# EAGLE schematic car v6 (EAGLE 9.7.0)
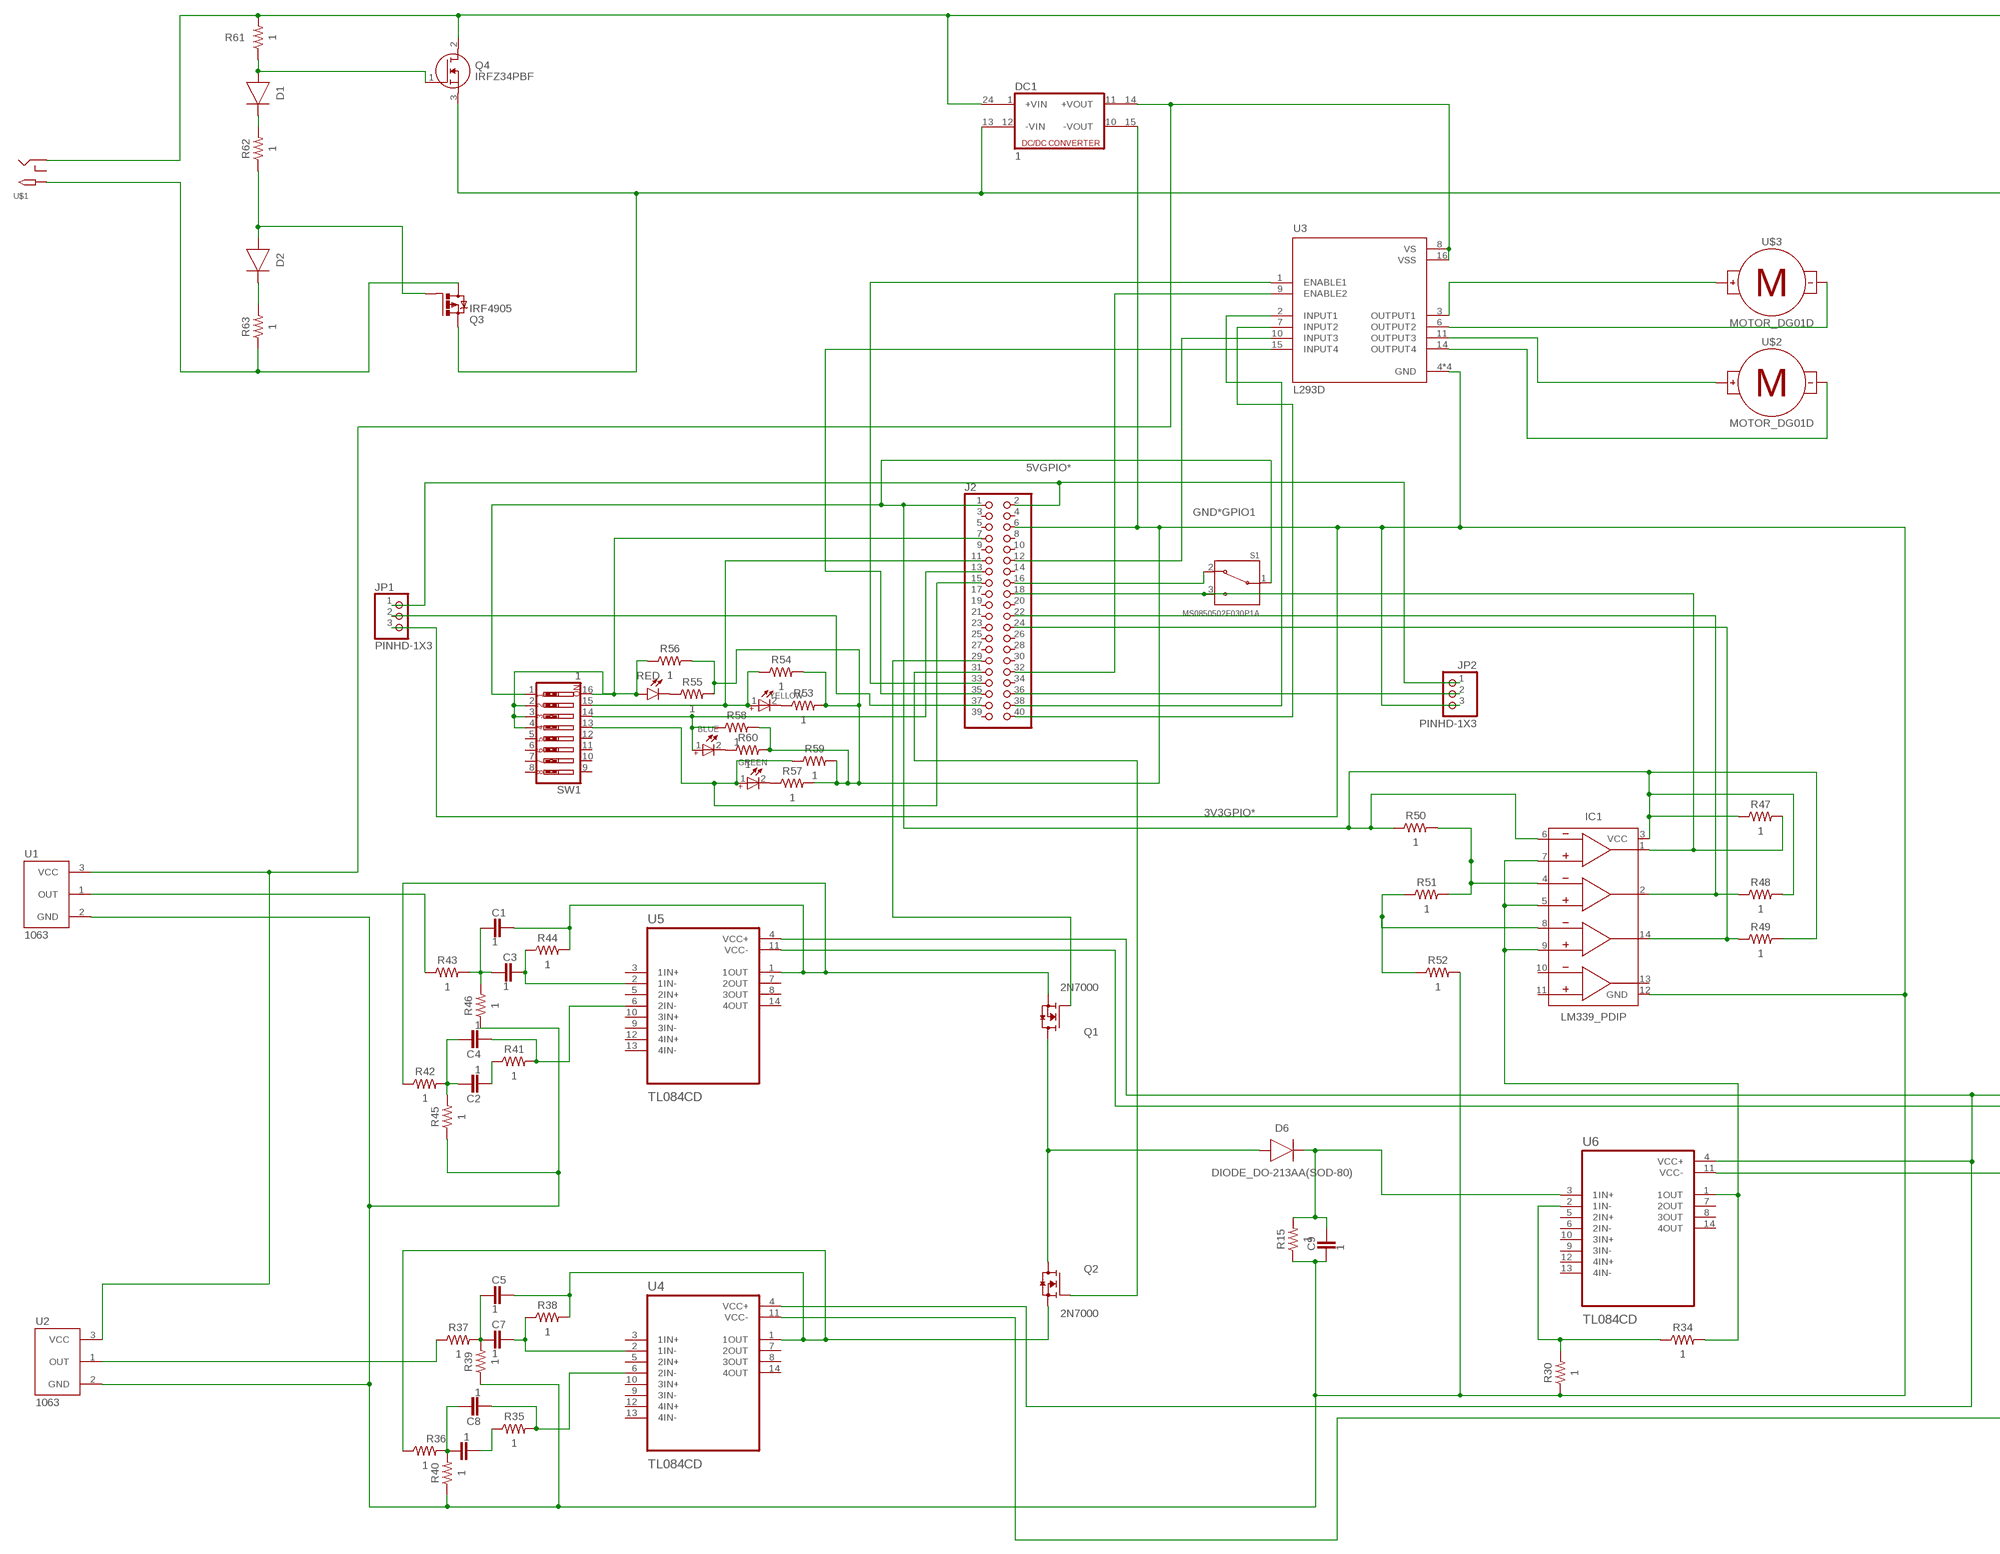
[diagram p0: schematic, sheet 1, part 1 of 2]
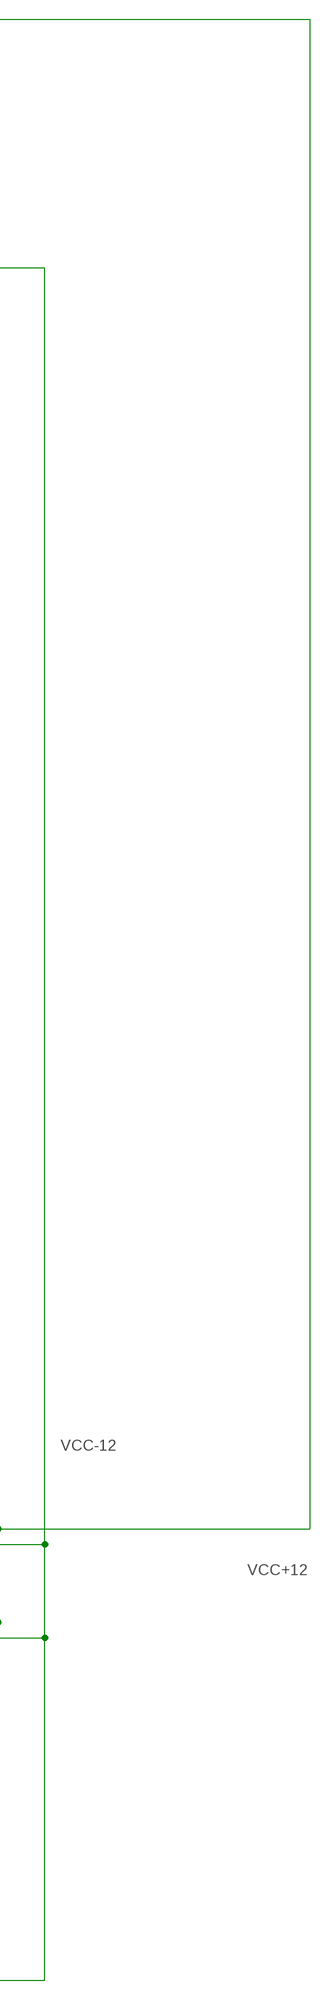
[diagram p1: schematic, sheet 1, part 2 of 2]

## Parts
BLUE  WL-TMRC_5MM_WITHOUTSTOPPER  [WL-TMRC_5MM]
C1  1  CAPACITOR_CHIP-0402(1005-METRIC)  [CAPC1005X60]
C2  1  CAPACITOR_CHIP-0402(1005-METRIC)  [CAPC1005X60]
C3  1  CAPACITOR_CHIP-0402(1005-METRIC)  [CAPC1005X60]
C4  1  CAPACITOR_CHIP-0402(1005-METRIC)  [CAPC1005X60]
C5  1  CAPACITOR_CHIP-0402(1005-METRIC)  [CAPC1005X60]
C6  1  CAPACITOR_CHIP-0402(1005-METRIC)  [CAPC1005X60]
C7  1  CAPACITOR_CHIP-0402(1005-METRIC)  [CAPC1005X60]
C8  1  CAPACITOR_CHIP-0402(1005-METRIC)  [CAPC1005X60]
C9  1  CAPACITOR_CHIP-0402(1005-METRIC)  [CAPC1005X60]
D1  DIODE_DO-213AA(SOD-80)  [DIOMELF3516]
D2  DIODE_DO-213AA(SOD-80)  [DIOMELF3516]
D6  DIODE_DO-213AA(SOD-80)  [DIOMELF3516]
DC1  1  DC213R  [CMK]
GREEN  WL-TMRC_3MM_WITHOUTSTOPPER  [WL-TMRC_3MM]
IC1  LM339_PDIP  [DIP762W53P254L1969H508Q14B]
J2  PiHeaderM  PINHD-2X20  [2X20]
JP1  PINHD-1X3  [1X03]
JP2  PINHD-1X3  [1X03]
Q1  2N7000  [TO92254P458H750-3]
Q2  2N7000  [TO92254P458H750-3]
Q3  IRF4905  [TO220BH]
Q4  IRFZ34PBF  [TO254P465X1024X2050-3P]
R15  1  R-US_CHIP-0402(1005-METRIC)  [RESC1005X40]
R30  1  R-US_CHIP-0402(1005-METRIC)  [RESC1005X40]
R34  1  R-US_CHIP-0402(1005-METRIC)  [RESC1005X40]
R35  1  R-US_CHIP-0402(1005-METRIC)  [RESC1005X40]
R36  1  R-US_CHIP-0402(1005-METRIC)  [RESC1005X40]
R37  1  R-US_CHIP-0402(1005-METRIC)  [RESC1005X40]
R38  1  R-US_CHIP-0402(1005-METRIC)  [RESC1005X40]
R39  1  R-US_CHIP-0402(1005-METRIC)  [RESC1005X40]
R40  1  R-US_CHIP-0402(1005-METRIC)  [RESC1005X40]
R41  1  R-US_CHIP-0402(1005-METRIC)  [RESC1005X40]
R42  1  R-US_CHIP-0402(1005-METRIC)  [RESC1005X40]
R43  1  R-US_CHIP-0402(1005-METRIC)  [RESC1005X40]
R44  1  R-US_CHIP-0402(1005-METRIC)  [RESC1005X40]
R45  1  R-US_CHIP-0402(1005-METRIC)  [RESC1005X40]
R46  1  R-US_CHIP-0402(1005-METRIC)  [RESC1005X40]
R47  1  R-US_CHIP-0402(1005-METRIC)  [RESC1005X40]
R48  1  R-US_CHIP-0402(1005-METRIC)  [RESC1005X40]
R49  1  R-US_CHIP-0402(1005-METRIC)  [RESC1005X40]
R50  1  R-US_CHIP-0402(1005-METRIC)  [RESC1005X40]
R51  1  R-US_CHIP-0402(1005-METRIC)  [RESC1005X40]
R52  1  R-US_CHIP-0402(1005-METRIC)  [RESC1005X40]
R53  1  R-US_CHIP-0402(1005-METRIC)  [RESC1005X40]
R54  1  R-US_CHIP-0402(1005-METRIC)  [RESC1005X40]
R55  1  R-US_CHIP-0402(1005-METRIC)  [RESC1005X40]
R56  1  R-US_CHIP-0402(1005-METRIC)  [RESC1005X40]
R57  1  R-US_CHIP-0402(1005-METRIC)  [RESC1005X40]
R58  1  R-US_CHIP-0402(1005-METRIC)  [RESC1005X40]
R59  1  R-US_CHIP-0402(1005-METRIC)  [RESC1005X40]
R60  1  R-US_CHIP-0402(1005-METRIC)  [RESC1005X40]
R61  1  R-US_CHIP-0402(1005-METRIC)  [RESC1005X40]
R62  1  R-US_CHIP-0402(1005-METRIC)  [RESC1005X40]
R63  1  R-US_CHIP-0402(1005-METRIC)  [RESC1005X40]
RED  LED_RADIALRED  [LEDRD254W60D565H860B_R]
S1  MS0850502F030P1A  [SW_MS0850502F030P1A]
SW1  1  SW_DIP-8  [EDG-08]
U1  1063  [MODULE_1063]
U2  1063  [MODULE_1063]
U3  L293D  [DIP880W50P254L2000H510Q16]
U4  TL084CD  [SOIC127P600X175-14N]
U5  TL084CD  [SOIC127P600X175-14N]
U6  TL084CD  [SOIC127P600X175-14N]
U$1  2.1MMJACKTHM  [PJ-102A]
U$2  MOTOR_DG01D  [DG01D]
U$3  MOTOR_DG01D  [DG01D]
YELLOW  WL-TMRC_3MM_WITHOUTSTOPPER  [WL-TMRC_3MM]

## Nets
3V3GPIO*: IC1.3(VCC) IC1.6(-IN1) J2.1 R47.1 R48.2 R49.2 R50.1 S1.1(COM) SW1.1
5VGPIO*: J2.2 JP1.1 JP2.1
GND*GPIO1: C9.2 DC1.15(-VOUT1) IC1.12(GND) J2.6 JP1.3 JP2.3 R15.1 R30.1 R39.1 R40.1 R45.1 R46.1 R52.2 R53.2 R54.2 R55.2 R56.2 R57.2 R58.2 R59.2 R60.2 U1.2(GND) U2.2(GND) U3.4(GND) U3.5(GND) U3.12(GND) U3.13(GND)
GPIO4*: J2.7 R56.1 RED.A SW1.2 SW1.3 SW1.4 SW1.16
GPIO5*: J2.29 Q1.2(G)
GPIO6*: J2.31 Q2.2(G)
GPIO8*: IC1.14(OUT3) J2.24 R49.1
GPIO12*: J2.32 U3.9(ENABLE2)
GPIO13*: J2.33 U3.1(ENABLE1)
GPIO16*: J2.36 JP2.2
GPIO17*: J2.11 R54.1 SW1.15 YELLOW.1(+)
GPIO18*: J2.12 U3.10(INPUT3)
GPIO19*: J2.35 U3.15(INPUT4)
GPIO20*: J2.38 U3.2(INPUT1)
GPIO21*: J2.40 U3.7(INPUT2)
GPIO22*: GREEN.1(+) J2.15 R59.1 SW1.13
GPIO23*: J2.16 S1.2(NC)
GPIO24*: IC1.1(OUT1) J2.18 R47.2 S1.3(NO)
GPIO25*: IC1.2(OUT2) J2.22 R48.1
GPIO26*: J2.37 JP1.2
GPIO27*: BLUE.1(+) J2.13 R58.1 SW1.14
N$1: D1.2(A) Q4.1(G) R61.1
N$2: D1.1(C) R62.2
N$3: D2.2(A) Q3.G R62.1
N$4: D2.1(C) R63.2
N$5: Q3.D R63.1 U$1.TIP
N$6: U3.11(OUTPUT3) U$2.+
N$7: U3.3(OUTPUT1) U$3.+
N$8: C1.2 C3.2 R43.2 R46.2
N$9: DC1.14(+VOUT1) U1.3(VCC) U2.3(VCC) U3.8(VS) U3.16(VSS)
N$12: C3.1 R44.1 U5.2(1IN-)
N$13: C2.1 C4.1 R42.2 R45.2
N$14: C2.2 R41.1
N$15: C1.1 Q1.1(S) R42.1 R44.2 U5.1(1OUT)
N$16: C4.2 R41.2 U5.6(2IN-)
N$17: R55.1 RED.C
N$18: R43.1 U1.1(OUT)
N$19: C5.2 C7.2 R37.2 R39.2
N$20: C7.1 R38.1 U4.2(1IN-)
N$21: C6.1 C8.1 R36.2 R40.2
N$22: C6.2 R35.1
N$23: C5.1 Q2.1(S) R36.1 R38.2 U4.1(1OUT)
N$24: C8.2 R35.2 U4.6(2IN-)
N$25: R53.1 YELLOW.2(-)
N$26: R37.1 U2.1(OUT)
N$27: C9.1 D6.1(C) R15.2 U6.3(1IN+)
N$28: GREEN.2(-) R57.1
N$29: D6.2(A) Q1.3(D) Q2.3(D)
N$30: BLUE.2(-) R60.1
N$31: IC1.4(-IN2) R50.2 R51.2
N$32: IC1.8(-IN3) R51.1 R52.1
N$33: U3.6(OUTPUT2) U$3.-
N$34: R30.2 R34.1 U6.2(1IN-)
N$35: IC1.5(+IN2) IC1.7(+IN1) IC1.9(+IN3) R34.2 U6.1(1OUT)
N$36: U3.14(OUTPUT4) U$2.-
VCC+12: DC1.24(+VIN1) Q4.2(D) R61.2 U4.4(VCC+) U5.4(VCC+) U6.4(VCC+) U$1.RING
VCC-12: DC1.13(-VIN1) Q3.S Q4.3(S) U4.11(VCC-) U5.11(VCC-) U6.11(VCC-)
Unconnected: DC1.1(+VIN) DC1.10(-VOUT) DC1.11(+VOUT) DC1.12(-VIN) IC1.10(-IN4) IC1.11(+IN4) IC1.13(OUT4) J2.3 J2.4 J2.5 J2.8 J2.9 J2.10 J2.14 J2.17 J2.19 J2.20 J2.21 J2.23 J2.25 J2.26 J2.27 J2.28 J2.30 J2.34 J2.39 SW1.5 SW1.6 SW1.7 SW1.8 SW1.9 SW1.10 SW1.11 SW1.12 U4.3(1IN+) U4.5(2IN+) U4.7(2OUT) U4.8(3OUT) U4.9(3IN-) U4.10(3IN+) U4.12(4IN+) U4.13(4IN-) U4.14(4OUT) U5.3(1IN+) U5.5(2IN+) U5.7(2OUT) U5.8(3OUT) U5.9(3IN-) U5.10(3IN+) U5.12(4IN+) U5.13(4IN-) U5.14(4OUT) U6.5(2IN+) U6.6(2IN-) U6.7(2OUT) U6.8(3OUT) U6.9(3IN-) U6.10(3IN+) U6.12(4IN+) U6.13(4IN-) U6.14(4OUT) U$1.RING_SW

## Library data of the parts
BLUE = WL-TMRC_5MM:WL-TMRC_5MM: Check availability <https://pricing.snapeda.com/parts/151051BS04000/Wurth%20Electronics/view-part?ref=eda>; AVAILABILITY: In Stock; CHECK_PRICES: https://www.snapeda.com/parts/151051BS04000/Wurth+Electronics/view-part/?ref=eda; DESCRIPTION: 5mm, Blue Typ.(@20mA): 470nm, 500mcd, 3.2V, 40° GaN; MF: Wurth Electronics; MP: 151051BS04000; PACKAGE: Package; PRICE: None; SNAPEDA_LINK: https://www.snapeda.com/parts/151051BS04000/Wurth+Electronics/view-part/?ref=snap
C1-C9 = Tinkercad:CAPACITOR: Capacitor - Generic; CATEGORY: Capacitor
D1 D2 D6 = Diode:DIODE: Diode Rectifier - Generic; CATEGORY: Diode; DESCRIPTION: Generic diode Surface Mount DO-213AA(SOD-80); PACKAGE_SIZE: SOD-80; PACKAGE_TYPE: SMD; SUBCATEGORY: Rectifiers
DC1 = dc-dc-converter:DC213R: DC-DC CONVERTER
GREEN = WL-TMRC_3MM:WL-TMRC_3MM: Check availability; AVAILABILITY: In Stock; CHECK_PRICES: https://www.snapeda.com/parts/151031VS06000/Wurth+Electronics/view-part/?ref=eda; DESCRIPTION: 3mm Bright Green Typ (@20mA) 568nm, 30mcd, 2.2V, 60° GaP/GaP; MF: Wurth Electronics; MP: 151031VS06000; PACKAGE: Radial Würth Elektronik; PRICE: None; SNAPEDA_LINK: https://www.snapeda.com/parts/151031VS06000/Wurth+Electronics/view-part/?ref=snap
IC1 = Tinkercad:LM339: Quad Comparators Reference Datasheet <https://www.ti.com/lit/ds/symlink/lm2901.pdf?ts=1637642838912&ref_url=https%253A%252F%252Fwww.ti.com%252Fproduct%252FLM2901>
J2 = adafruit:PINHD-2X20: PIN HEADER
JP1 JP2 = Connector:PINHD-1X3: PIN HEADER; CATEGORY: Headers; DESCRIPTION: Header-Straight-3 Position; PACKAGE_TYPE: THT; PITCH: 0.100" (2.54mm); SUBCATEGORY: Headers-Male Pins; TYPE: Board to Board or Cable-Unshrouded-Through Hole-Straight
Q1 Q2 = 2N7000:2N7000: Check availability <https://pricing.snapeda.com/parts/2N7000/Diotec%20Semiconductor/view-part?ref=eda>; AVAILABILITY: In Stock; CHECK_PRICES: https://www.snapeda.com/parts/2N7000/Diotec/view-part/?ref=eda; DESCRIPTION: MOSFET, TO-92, N, 60V, 0.2A, 5Ω, 150°C; MF: Diotec Semiconductor; MP: 2N7000; PACKAGE: TO-92 Diotec; PRICE: None; SNAPEDA_LINK: https://www.snapeda.com/parts/2N7000/Diotec/view-part/?ref=snap
Q3 = IRF4905:IRF4905: Check availability <https://pricing.snapeda.com/parts/IRF4905/Infineon%20Technologies/view-part?ref=eda>; AVAILABILITY: Not in stock; CHECK_PRICES: https://www.snapeda.com/parts/IRF4905/Infineon/view-part/?ref=eda; DESCRIPTION: P-Channel 55 V 74A (Tc) 200W (Tc) Through Hole TO-220AB; MF: Infineon Technologies; MP: IRF4905; PACKAGE: TO-220 Infineon; PRICE: None; SNAPEDA_LINK: https://www.snapeda.com/parts/IRF4905/Infineon/view-part/?ref=snap
Q4 = IRFZ34PBF:IRFZ34PBF: Trans MOSFET N-CH 60V 30A Source: Datasheet <https://www.vishay.com/docs/91290/91290.pdf>; ARROW_PART_NUMBER: IRFZ34PBF; ARROW_PRICE-STOCK: https://www.arrow.com/en/products/irfz34pbf/vishay?region=nac; DESCRIPTION: Trans MOSFET N-CH 60V 30A; HEIGHT: 4.65mm; MANUFACTURER_NAME: Vishay; MANUFACTURER_PART_NUMBER: IRFZ34PBF; MOUSER_PART_NUMBER: 844-IRFZ34PBF; MOUSER_PRICE-STOCK: https://www.mouser.co.uk/ProductDetail/Vishay-Semiconductors/IRFZ34PBF?qs=I1ZA2VTqfvRg%2FcYzigS1jg%3D%3D
R15 R30 R34-R63 = Resistor:R-US: Resistor Fixed - ANSI; CATEGORY: Resistors; DESCRIPTION: Chip Resistor 1.05 X 0.54 X 0.40 mm body 0402(1005-METRIC) Package; PACKAGE_SIZE: 0402; PACKAGE_TYPE: SMD
RED = Opto-Electronic:LED_RADIAL: LED - Generic; CATEGORY: Optoelectronics; COLOR: Red; DESCRIPTION: Radial LED (Round) 2.54 mm pitch 5.65 mm body diameter 8.60 mm body height Red; PACKAGE_SIZE: 5mm; PACKAGE_TYPE: THT; SUBCATEGORY: LED; TYPE: Round
S1 = MS0850502F030P1A:MS0850502F030P1A: Check availability <https://pricing.snapeda.com/parts/MS0850502F030P1A/E-Switch/view-part?ref=eda>; AVAILABILITY: In Stock; CHECK_PRICES: https://www.snapeda.com/parts/MS0850502F030P1A/E-Switch/view-part/?ref=eda; DESCRIPTION: Snap Action Switch, SPDT, ON-MOM, MS Series, Straight Lever, 5A, 125VAC, PC Pin | E-Switch MS0850502F030P1A; MF: E-Switch; MP: MS0850502F030P1A; PACKAGE: None; PRICE: None; SNAPEDA_LINK: https://www.snapeda.com/parts/MS0850502F030P1A/E-Switch/view-part/?ref=snap
SW1 = special:SW_DIP-8: DIP SWITCH
U1 U2 = 1063:1063: Check availability <https://pricing.snapeda.com/parts/1063/Adafruit/view-part?ref=eda>; AVAILABILITY: In Stock; CHECK_PRICES: https://www.snapeda.com/parts/1063/Adafruit+Industries/view-part/?ref=eda; DESCRIPTION: Electret Microphone Amplifier - MAX4466 with Adjustable Gain | Adafruit Industries 1063; MF: Adafruit; MP: 1063; PACKAGE: None; PRICE: None; SNAPEDA_LINK: https://www.snapeda.com/parts/1063/Adafruit+Industries/view-part/?ref=snap
U3 = L293D:L293D: Check availability <https://pricing.snapeda.com/parts/L293D/STMicroelectronics/view-part?ref=eda>; AVAILABILITY: In Stock; CHECK_PRICES: https://www.snapeda.com/parts/L293D/STMicroelectronics/view-part/?ref=eda; DESCRIPTION: Bipolar Motor Driver - Parallel 16-PowerDIP; MF: STMicroelectronics; MP: L293D; PACKAGE: DIP-16 STMicroelectronics; PRICE: None; SNAPEDA_LINK: https://www.snapeda.com/parts/L293D/STMicroelectronics/view-part/?ref=snap
U4-U6 = TL084CD:TL084CD; CHECK_PRICES: https://www.snapeda.com/parts/TL084CD/Texas+Instruments/view-part/?ref=eda; DESCRIPTION: Quad, 30-V, 3-MHz, 13-V/µs slew rate, In to V+, JFET-input op amp; DIGIKEY_PART_NUMBER: 296-1285-5-ND; MF: Texas Instruments; MP: TL084CD; PACKAGE: SOIC-14 Texas Instruments; SNAPEDA_LINK: https://www.snapeda.com/parts/TL084CD/Texas+Instruments/view-part/?ref=snap
U$1 = adafruit:2.1MMJACK: 2.1mm x 5.5mm THM DC jack with internal switch. Digikey part #PJ-102A, 4UCON part #05537 2.1mm x 5.5mm SMT DC jack with internal switch. Digikey part #PJ-002A-SMT, 4UCON part #03267 By microbuilder.eu & adafruit.com
U$2 U$3 = Tinkercad:MOTOR
YELLOW = WL-TMRC_3MM-2:WL-TMRC_3MM: Check availability; AVAILABILITY: In Stock; CHECK_PRICES: https://www.snapeda.com/parts/151031YS06000/Wurth+Electronics/view-part/?ref=eda; DESCRIPTION: 3mm, Yellow Typ (@20mA) 590nm, 110mcd, 2.0V, 60° AlInGaP; MF: Wurth Electronics; MP: 151031YS06000; PACKAGE: Radial Würth Elektronik; PRICE: None; SNAPEDA_LINK: https://www.snapeda.com/parts/151031YS06000/Wurth+Electronics/view-part/?ref=snap